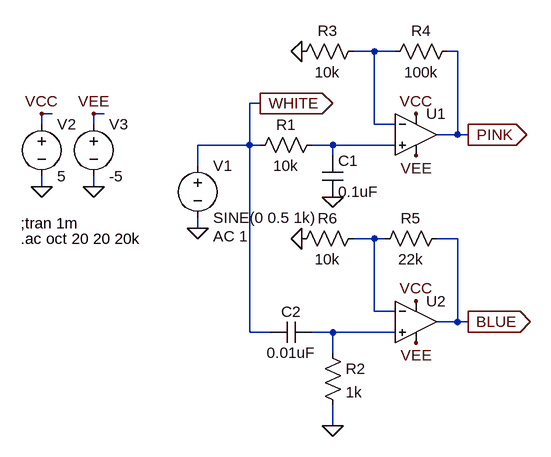
[diagram p0: schematic colored_noise1.asc]
colored_noise1.asc, the LTspice schematic file:
Version 4
SHEET 1 880 680
WIRE 304 -32 272 -32
WIRE 336 -32 304 -32
WIRE 432 -32 416 -32
WIRE 128 48 112 48
WIRE -192 64 -208 64
WIRE -112 64 -128 64
WIRE -208 80 -208 64
WIRE -128 80 -128 64
WIRE 304 80 304 -32
WIRE 336 80 304 80
WIRE 432 96 432 -32
WIRE 432 96 400 96
WIRE 448 96 432 96
WIRE 112 112 112 48
WIRE 112 112 32 112
WIRE 128 112 112 112
WIRE 240 112 208 112
WIRE 336 112 240 112
WIRE 240 128 240 112
WIRE 32 144 32 112
WIRE -208 176 -208 160
WIRE -128 176 -128 160
WIRE 32 240 32 224
WIRE 304 256 272 256
WIRE 320 256 304 256
WIRE 432 256 400 256
WIRE 304 368 304 256
WIRE 336 368 304 368
WIRE 432 384 432 256
WIRE 432 384 400 384
WIRE 448 384 432 384
WIRE 112 400 112 112
WIRE 144 400 112 400
WIRE 240 400 208 400
WIRE 336 400 240 400
WIRE 240 432 240 400
WIRE 240 544 240 512
FLAG 240 192 0
FLAG 32 240 0
FLAG 368 64 VCC
FLAG 368 128 VEE
FLAG 448 96 PINK
IOPIN 448 96 Out
FLAG -208 176 0
FLAG -128 176 0
FLAG -208 64 VCC
FLAG -128 64 VEE
FLAG 240 544 0
FLAG 368 352 VCC
FLAG 368 416 VEE
FLAG 448 384 BLUE
IOPIN 448 384 Out
FLAG 128 48 WHITE
IOPIN 128 48 Out
FLAG 192 -32 0
FLAG 192 256 0
SYMBOL voltage 32 128 R0
WINDOW 123 24 124 Left 2
WINDOW 39 0 0 Left 2
SYMATTR Value2 AC 1
SYMATTR InstName V1
SYMATTR Value SINE(0 0.5 1k)
SYMBOL Opamps\\UniversalOpamp2 368 96 R0
SYMATTR InstName U1
SYMBOL voltage -208 64 R0
SYMATTR InstName V2
SYMATTR Value 5
SYMBOL voltage -128 64 R0
SYMATTR InstName V3
SYMATTR Value -5
SYMBOL res 224 96 R90
WINDOW 0 0 56 VBottom 2
WINDOW 3 32 56 VTop 2
SYMATTR InstName R1
SYMATTR Value 10k
SYMBOL cap 224 128 R0
SYMATTR InstName C1
SYMATTR Value 0.1uF
SYMBOL Opamps\\UniversalOpamp2 368 384 R0
SYMATTR InstName U2
SYMBOL cap 208 384 R90
WINDOW 0 0 32 VBottom 2
WINDOW 3 32 32 VTop 2
SYMATTR InstName C2
SYMATTR Value 0.01uF
SYMBOL res 224 416 R0
SYMATTR InstName R2
SYMATTR Value 1k
SYMBOL res 288 -48 R90
WINDOW 0 0 56 VBottom 2
WINDOW 3 32 56 VTop 2
SYMATTR InstName R3
SYMATTR Value 10k
SYMBOL res 432 -48 R90
WINDOW 0 0 56 VBottom 2
WINDOW 3 32 56 VTop 2
SYMATTR InstName R4
SYMATTR Value 100k
SYMBOL res 416 240 R90
WINDOW 0 0 56 VBottom 2
WINDOW 3 32 56 VTop 2
SYMATTR InstName R5
SYMATTR Value 22k
SYMBOL res 288 240 R90
WINDOW 0 0 56 VBottom 2
WINDOW 3 32 56 VTop 2
SYMATTR InstName R6
SYMATTR Value 10k
TEXT -240 232 Left 2 !;tran 1m
TEXT -240 256 Left 2 !.ac oct 20 20 20k

The netlist it stands for:
* colored_noise1.asc
V1 WHITE 0 SINE(0 0.5 1k) AC 1
XU1 N002 N001 VCC VEE PINK level.2 Avol=1Meg GBW=10Meg Slew=10Meg ilimit=25m rail=0 Vos=0 phimargin=45 en=0 enk=0 in=0 ink=0 Rin=500Meg  ; pins IN+ IN- V+ V- OUT
V2 VCC 0 5
V3 VEE 0 -5
R1 N002 WHITE 10k
C1 N002 0 0.1uF
XU2 N004 N003 VCC VEE BLUE level.2 Avol=1Meg GBW=10Meg Slew=10Meg ilimit=25m rail=0 Vos=0 phimargin=45 en=0 enk=0 in=0 ink=0 Rin=500Meg  ; pins IN+ IN- V+ V- OUT
C2 N004 WHITE 0.01uF
R2 N004 0 1k
R3 N001 0 10k
R4 PINK N001 100k
R5 BLUE N003 22k
R6 N003 0 10k
;tran 1m
.ac oct 20 20 20k
.lib UniversalOpamps2.sub
.backanno
.end